# EAGLE design Mutli-Stepper-Driver Rev 2 MRlocal (EAGLE 8.0.0)

## Sheet 1 of 5
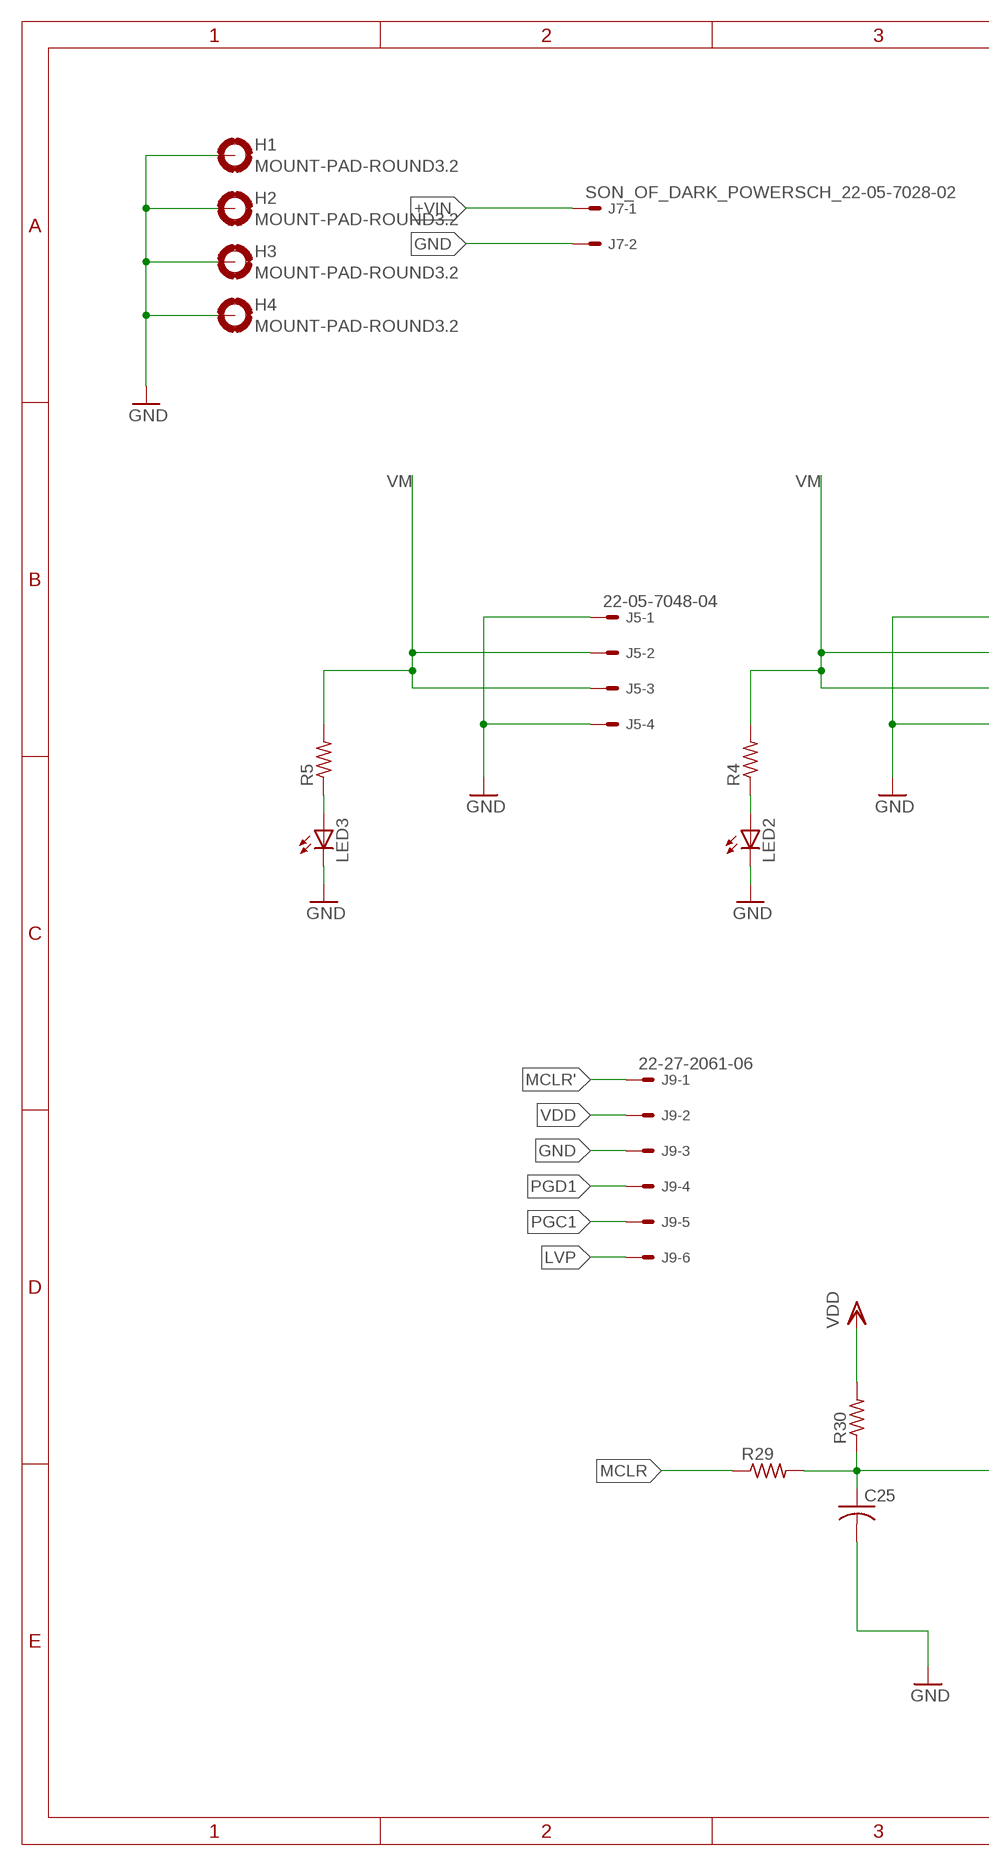
[diagram p0: schematic, sheet 1, part 1 of 2]
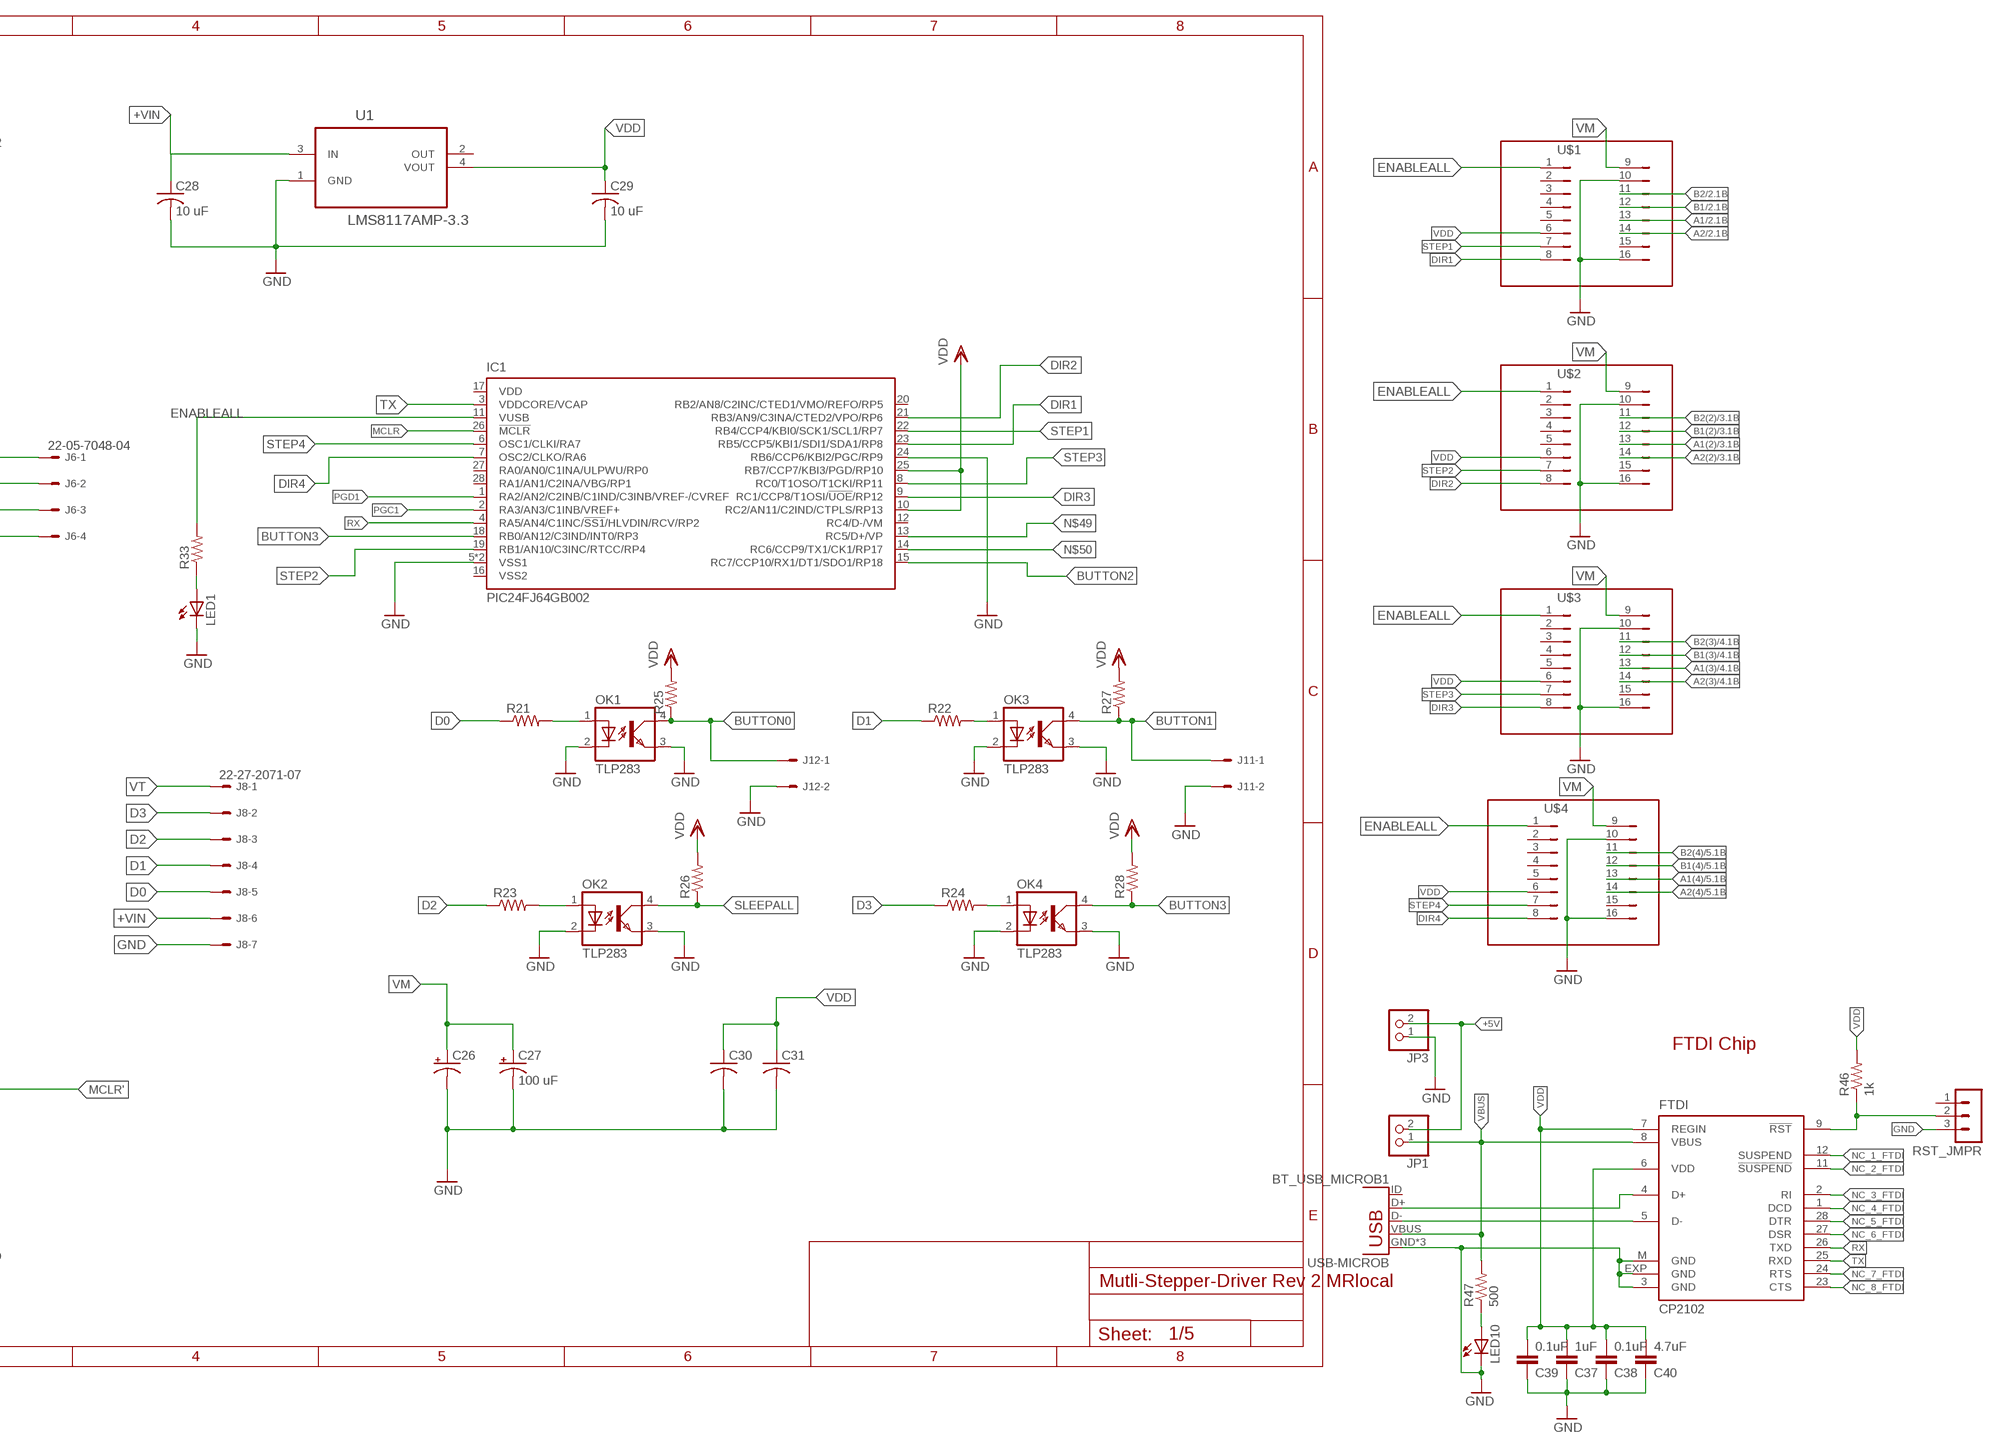
[diagram p1: schematic, sheet 1, part 2 of 2]

### Parts
BT_USB_MICROB1  USB-MICROB  [USB-MICROB]
C25  C-USC0805  [C0805]
C26  CPOL-USCT7343  [CT7343]
C27  100 uF  CPOL-USCT7343  [CT7343]
C28  10 uF  C-USC3216  [C3216]
C29  10 uF  C-USC3216  [C3216]
C30  C-USC0805  [C0805]
C31  C-USC0805  [C0805]
C37  1uF  C-EUC0805  [C0805]
C38  0.1uF  C-EUC0805  [C0805]
C39  0.1uF  C-EUC0805  [C0805]
C40  4.7uF  C-EUC0805  [C0805]
FTDI  CP2102  [MLP28]
H1  MOUNT-PAD-ROUND3.2  [3,2-PAD]
H2  MOUNT-PAD-ROUND3.2  [3,2-PAD]
H3  MOUNT-PAD-ROUND3.2  [3,2-PAD]
H4  MOUNT-PAD-ROUND3.2  [3,2-PAD]
IC1  PIC24FJ64GB002  MICROCHIP_PIC18F2J53ML  [MICROCHIP_QFN28-ML_6X6MM]
J5  22-05-7048-04  [7395-04]
J6  22-05-7048-04  [7395-04]
J7  SON_OF_DARK_POWERSCH_22-05-7028-02  [SON_OF_DARK_POWERSCH_7395-02]
J8  22-27-2071-07  [6410-07]
J9  22-27-2061-06  [6410-06]
J11  SON_OF_DARK_POWERSCH_22-05-7028-02  [SON_OF_DARK_POWERSCH_7395-02]
J12  SON_OF_DARK_POWERSCH_22-05-7028-02  [SON_OF_DARK_POWERSCH_7395-02]
JP1  PINHD-1X2  [1X02]
JP3  PINHD-1X2  [1X02]
LED1  LEDCHIPLED_0805  [CHIPLED_0805]
LED2  LEDCHIPLED_0805  [CHIPLED_0805]
LED3  LEDCHIPLED_0805  [CHIPLED_0805]
LED10  LEDSML0603  [SML0603]
OK1  TLP283  [MINI-FLAT-4]
OK2  TLP283  [MINI-FLAT-4]
OK3  TLP283  [MINI-FLAT-4]
OK4  TLP283  [MINI-FLAT-4]
R4  R-US_R0805  [R0805]
R5  R-US_R0805  [R0805]
R21  R-US_R0805  [R0805]
R22  R-US_R0805  [R0805]
R23  R-US_R0805  [R0805]
R24  R-US_R0805  [R0805]
R25  R-US_R0805  [R0805]
R26  R-US_R0805  [R0805]
R27  R-US_R0805  [R0805]
R28  R-US_R0805  [R0805]
R29  R-US_R0805  [R0805]
R30  R-US_R0805  [R0805]
R33  R-US_R0805  [R0805]
R46  1k  R-US_R0805  [R0805]
R47  500  R-US_R0805  [R0805]
RST_JMPR  MA03-1  [MA03-1]
U1  LMS8117AMP-3.3  NSC-LMS8117AMP_LMS8117AMP-3.3  [NSC-LMS8117AMP_SOT230P696X180-4N]
U$1  DRIVER  [6410-08]
U$2  DRIVER  [6410-08]
U$3  DRIVER  [6410-08]
U$4  DRIVER  [6410-08]

### Nets
+5V: JP1.2 JP3.2
+VIN: C28.1 J7.1 J8.6 U1.3(IN)
A1: U$1.13 ; also sheet 2
A1(2): U$2.13 ; also sheet 3
A1(3): U$3.13 ; also sheet 4
A1(4): U$4.13 ; also sheet 5
A2: U$1.14 ; also sheet 2
A2(2): U$2.14 ; also sheet 3
A2(3): U$3.14 ; also sheet 4
A2(4): U$4.14 ; also sheet 5
B1: U$1.12 ; also sheet 2
B1(2): U$2.12 ; also sheet 3
B1(3): U$3.12 ; also sheet 4
B1(4): U$4.12 ; also sheet 5
B2: U$1.11 ; also sheet 2
B2(2): U$2.11 ; also sheet 3
B2(3): U$3.11 ; also sheet 4
B2(4): U$4.11 ; also sheet 5
BT_D+: BT_USB_MICROB1.D+ FTDI.4(D+)
BT_D-: BT_USB_MICROB1.D- FTDI.5(D-)
BUTTON0: J12.1 OK1.4(COL) R25.1
BUTTON1: J11.1 OK3.4(COL) R27.1
BUTTON2: IC1.15(RC7/CCP10/RX1/DT1/SDO1/RP18)
BUTTON3: IC1.18(RB0/AN12/C3IND/INT0/RP3) OK4.4(COL) R28.1
D0: J8.5 R21.1
D1: J8.4 R22.1
D2: J8.3 R23.1
D3: J8.2 R24.1
DIR1: IC1.23(RB5/CCP5/KBI1/SDI1/SDA1/RP8) U$1.8
DIR2: IC1.21(RB3/AN9/C3INA/CTED2/VPO/RP6) U$2.8
DIR3: IC1.9(RC1/CCP8/T1OSI/!UOE!/RP12) U$3.8
DIR4: IC1.7(OSC2/CLKO/RA6) U$4.8
ENABLEALL: IC1.11(VUSB) R33.2 U$1.1 U$2.1 U$3.1 U$4.1
GND: BT_USB_MICROB1.GND BT_USB_MICROB1.MT1(GND) BT_USB_MICROB1.MT2(GND) C25.2 C26.- C27.- C28.2 C29.2 C30.2 C31.2 C37.1 C38.1 C39.1 C40.1 FTDI.3(GND) FTDI.EXP(GND) FTDI.M(GND) H1.B3,2(MOUNT) H2.B3,2(MOUNT) H3.B3,2(MOUNT) H4.B3,2(MOUNT) IC1.5(VSS1) IC1.24(RB6/CCP6/KBI2/PGC/RP9) IC1.EXP(VSS1) J5.1 J5.4 J6.1 J6.4 J7.2 J8.7 J9.3 J11.2 J12.2 JP3.1 LED1.C LED2.C LED3.C LED10.C OK1.2(C) OK1.3(EMIT) OK2.2(C) OK2.3(EMIT) OK3.2(C) OK3.3(EMIT) OK4.2(C) OK4.3(EMIT) RST_JMPR.3 U1.1(GND) U$1.10 U$1.16 U$2.10 U$2.16 U$3.10 U$3.16 U$4.10 U$4.16
LVP: J9.6
MCLR: IC1.26(!MCLR) R29.1
MCLR': C25.1 J9.1 R29.2 R30.1
N$2: LED2.A R4.1
N$9: FTDI.9(!RST) R46.1 RST_JMPR.2
N$10: LED10.A R47.1
N$12: LED3.A R5.1
N$37: OK2.1(A) R23.2
N$40: OK4.1(A) R24.2
N$42: LED1.A R33.1
N$43: OK1.1(A) R21.2
N$47: OK3.1(A) R22.2
N$49: IC1.13(RC5/D+/VP)
N$50: IC1.14(RC6/CCP9/TX1/CK1/RP17)
NC_1_FTDI: FTDI.12(SUSPEND)
NC_2_FTDI: FTDI.11(!SUSPEND)
NC_3_FTDI: FTDI.2(RI)
NC_4_FTDI: FTDI.1(DCD)
NC_5_FTDI: FTDI.28(DTR)
NC_6_FTDI: FTDI.27(DSR)
NC_7_FTDI: FTDI.24(RTS)
NC_8_FTDI: FTDI.23(CTS)
PGC1: IC1.2(RA3/AN3/C1INB/VREF+) J9.5
PGD1: IC1.1(RA2/AN2/C2INB/C1IND/C3INB/VREF-/CVREF) J9.4
RX: FTDI.26(TXD) IC1.4(RA5/AN4/C1INC/!SS1!/HLVDIN/RCV/RP2)
SLEEPALL: OK2.4(COL) R26.1
STEP1: IC1.22(RB4/CCP4/KBI0/SCK1/SCL1/RP7) U$1.7
STEP2: IC1.19(RB1/AN10/C3INC/RTCC/RP4) U$2.7
STEP3: IC1.8(RC0/T1OSO/T1CKI/RP11) U$3.7
STEP4: IC1.6(OSC1/CLKI/RA7) U$4.7
TX: FTDI.25(RXD) IC1.3(VDDCORE/VCAP)
VBUS: BT_USB_MICROB1.VBUS FTDI.8(VBUS) JP1.1 R47.2
VDD: C29.1 C30.1 C31.1 C37.2 C38.2 C39.2 C40.2 FTDI.6(VDD) FTDI.7(REGIN) IC1.10(RC2/AN11/C2IND/CTPLS/RP13) IC1.25(RB7/CCP7/KBI3/PGD/RP10) J9.2 R25.2 R26.2 R27.2 R28.2 R30.2 R46.2 U1.4(VOUT) U$1.6 U$2.6 U$3.6 U$4.6
VM: C26.+ C27.+ J5.2 J5.3 J6.2 J6.3 R4.2 R5.2 U$1.9 U$2.9 U$3.9 U$4.9
VT: J8.1
Unconnected: BT_USB_MICROB1.ID IC1.12(RC4/D-/VM) IC1.16(VSS2) IC1.17(VDD) IC1.20(RB2/AN8/C2INC/CTED1/VMO/REFO/RP5) IC1.27(RA0/AN0/C1INA/ULPWU/RP0) IC1.28(RA1/AN1/C2INA/VBG/RP1) RST_JMPR.1 U1.2(OUT) U$1.2 U$1.3 U$1.4 U$1.5 U$1.15 U$2.2 U$2.3 U$2.4 U$2.5 U$2.15 U$3.2 U$3.3 U$3.4 U$3.5 U$3.15 U$4.2 U$4.3 U$4.4 U$4.5 U$4.15

### Notes on the sheet
- FTDI Chip

## Sheet 2 of 5
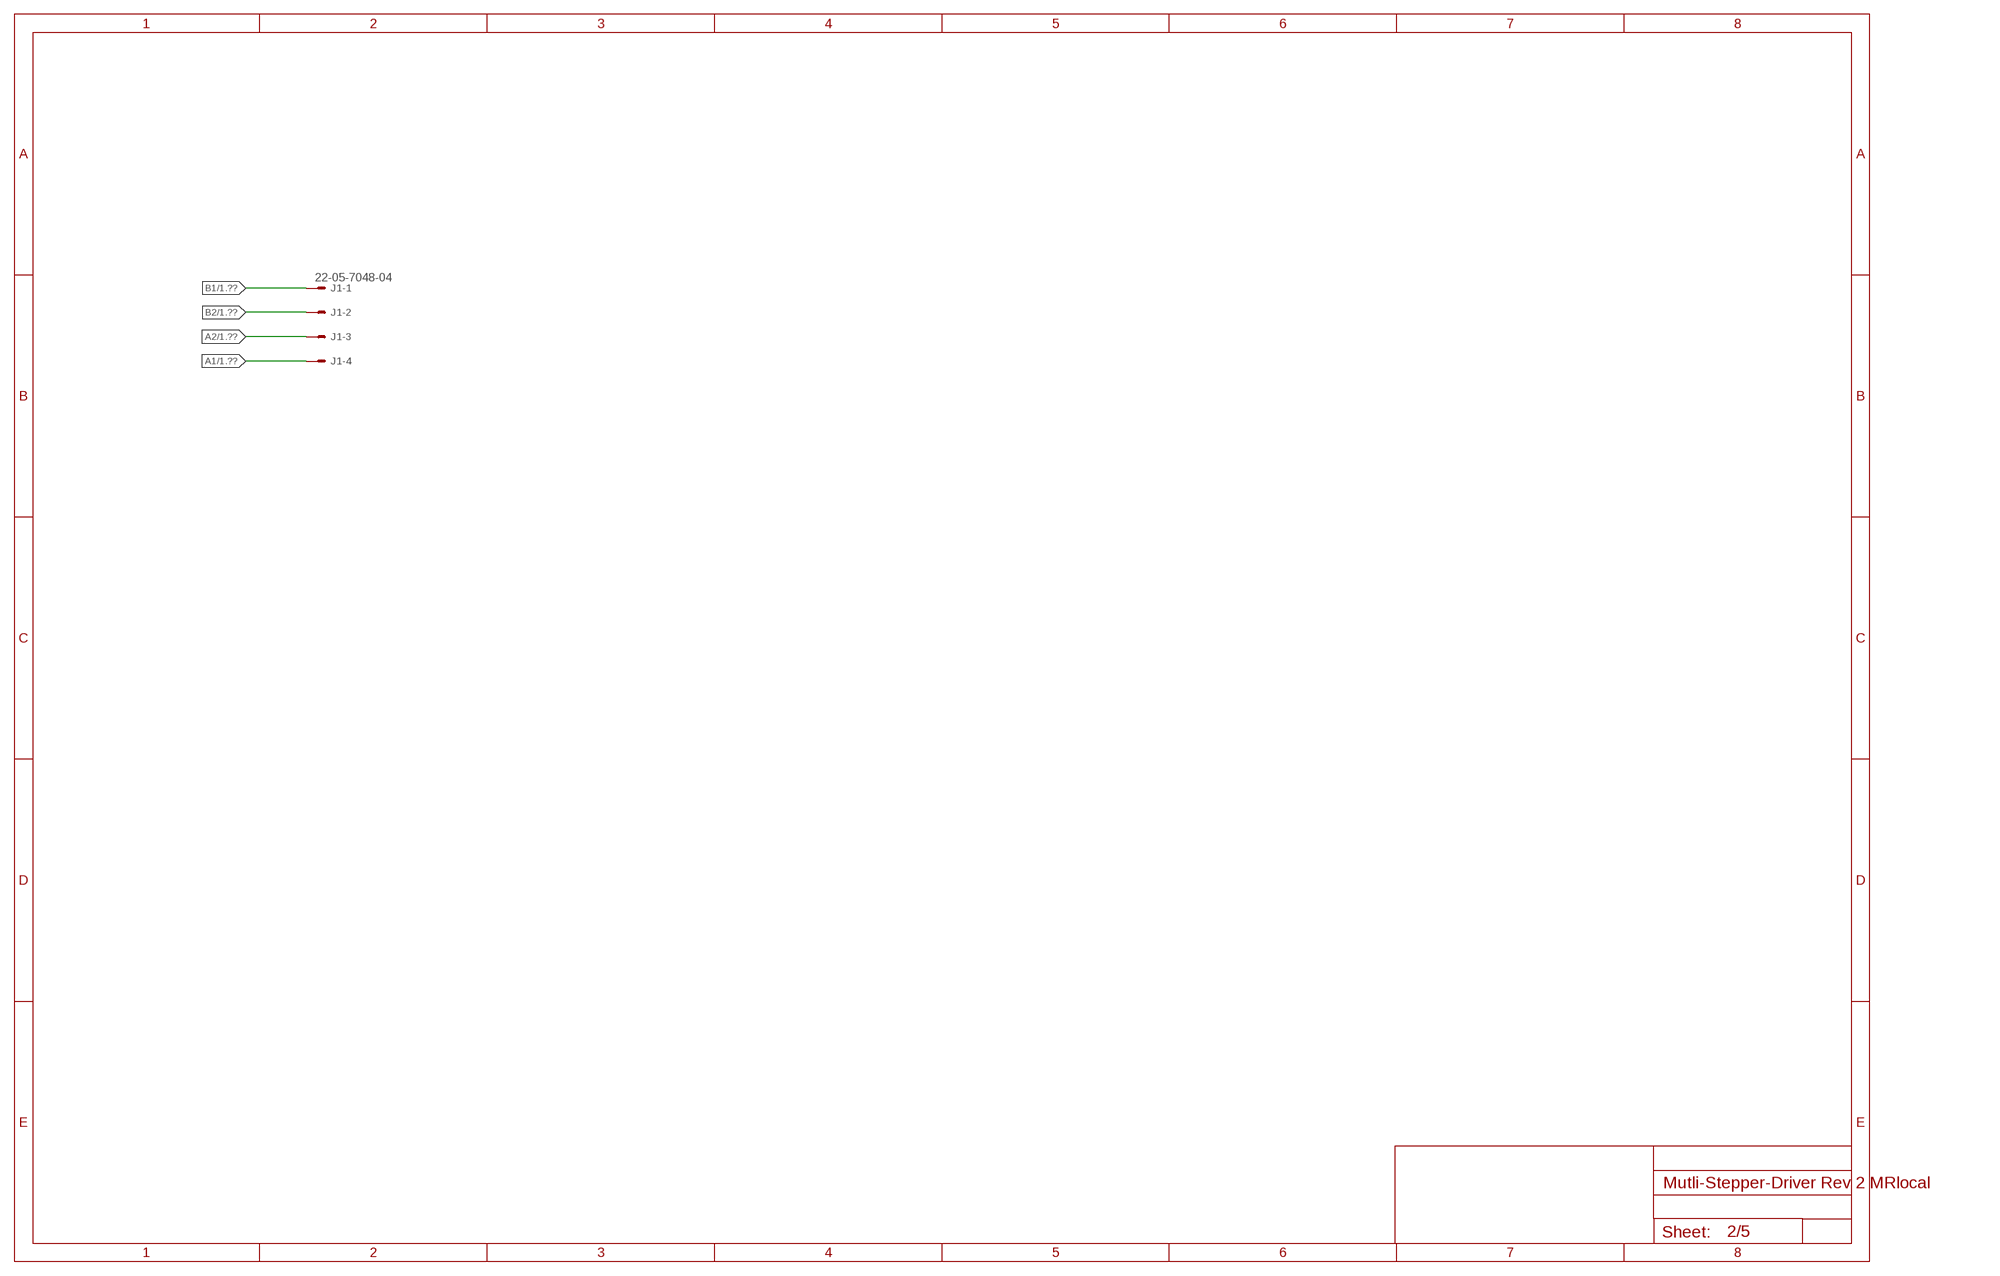
[diagram p2: schematic, sheet 2]

### Parts
J1  22-05-7048-04  [7395-04]

### Nets
A1: J1.4 ; also sheet 1
A2: J1.3 ; also sheet 1
B1: J1.1 ; also sheet 1
B2: J1.2 ; also sheet 1

## Sheet 3 of 5
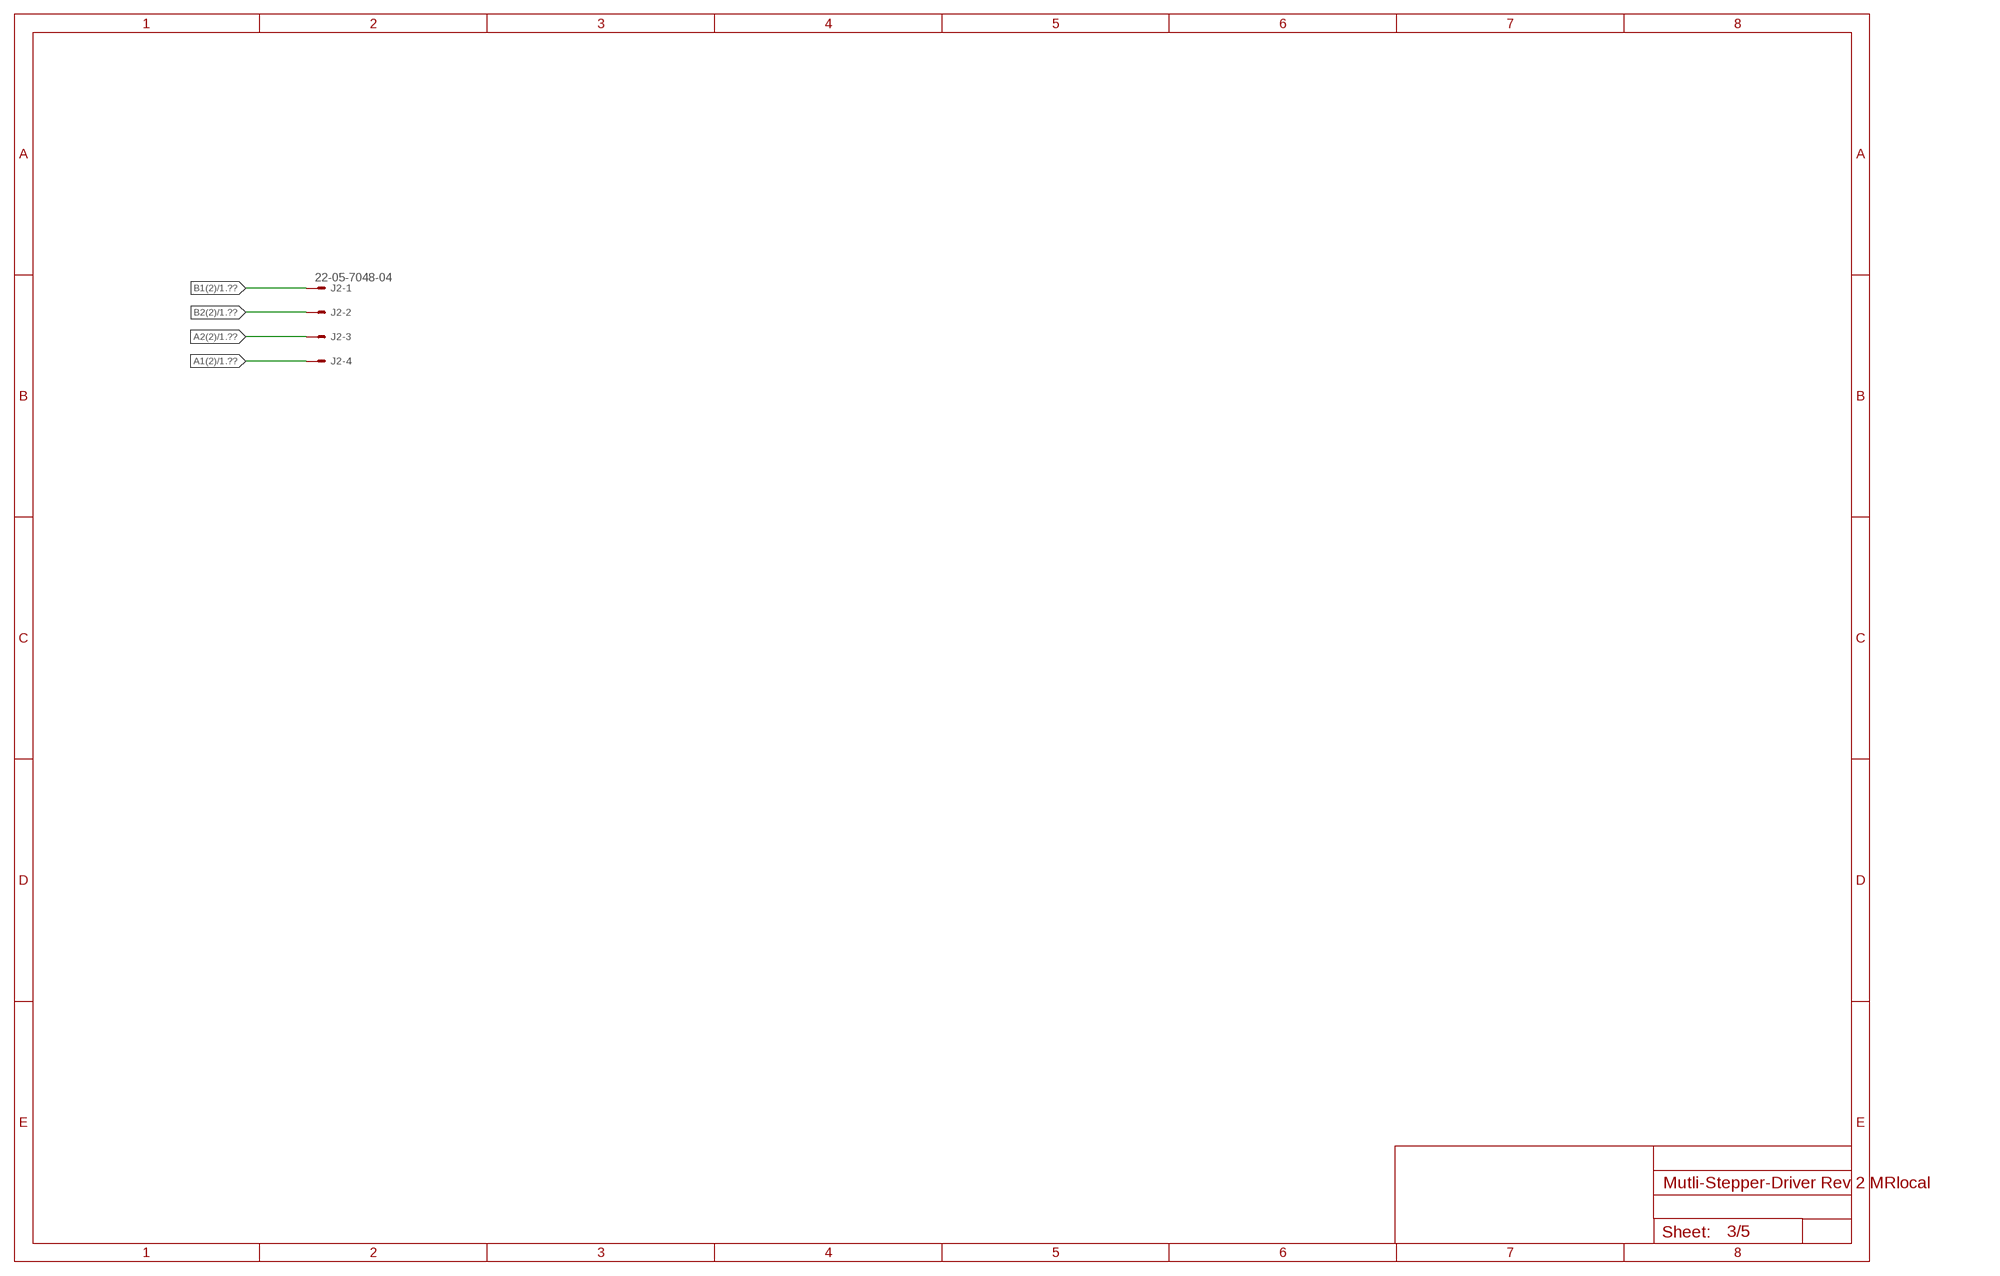
[diagram p3: schematic, sheet 3]

### Parts
J2  22-05-7048-04  [7395-04]

### Nets
A1(2): J2.4 ; also sheet 1
A2(2): J2.3 ; also sheet 1
B1(2): J2.1 ; also sheet 1
B2(2): J2.2 ; also sheet 1

## Sheet 4 of 5
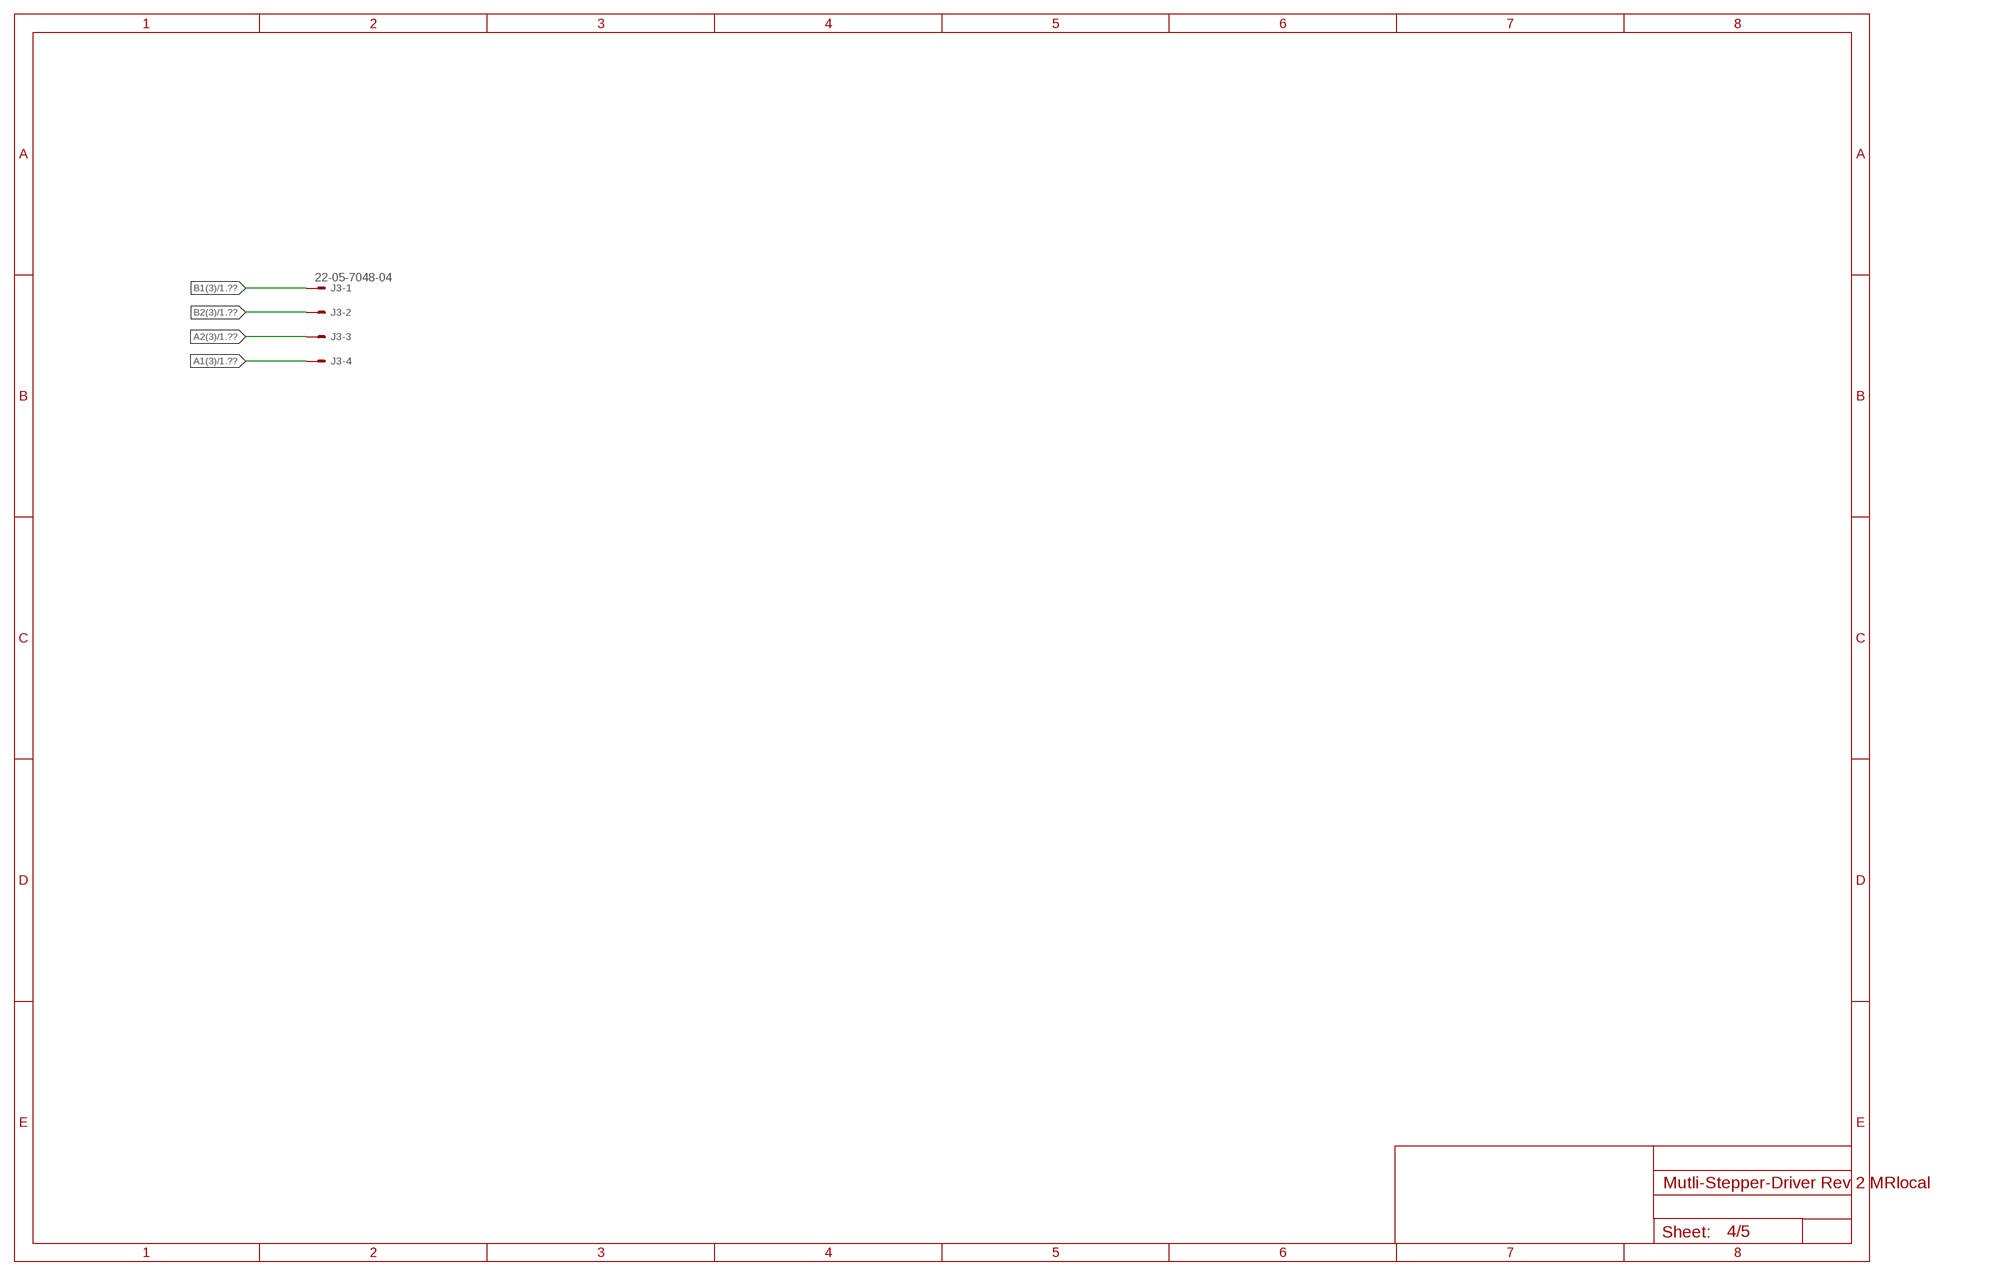
[diagram p4: schematic, sheet 4]

### Parts
J3  22-05-7048-04  [7395-04]

### Nets
A1(3): J3.4 ; also sheet 1
A2(3): J3.3 ; also sheet 1
B1(3): J3.1 ; also sheet 1
B2(3): J3.2 ; also sheet 1

## Sheet 5 of 5
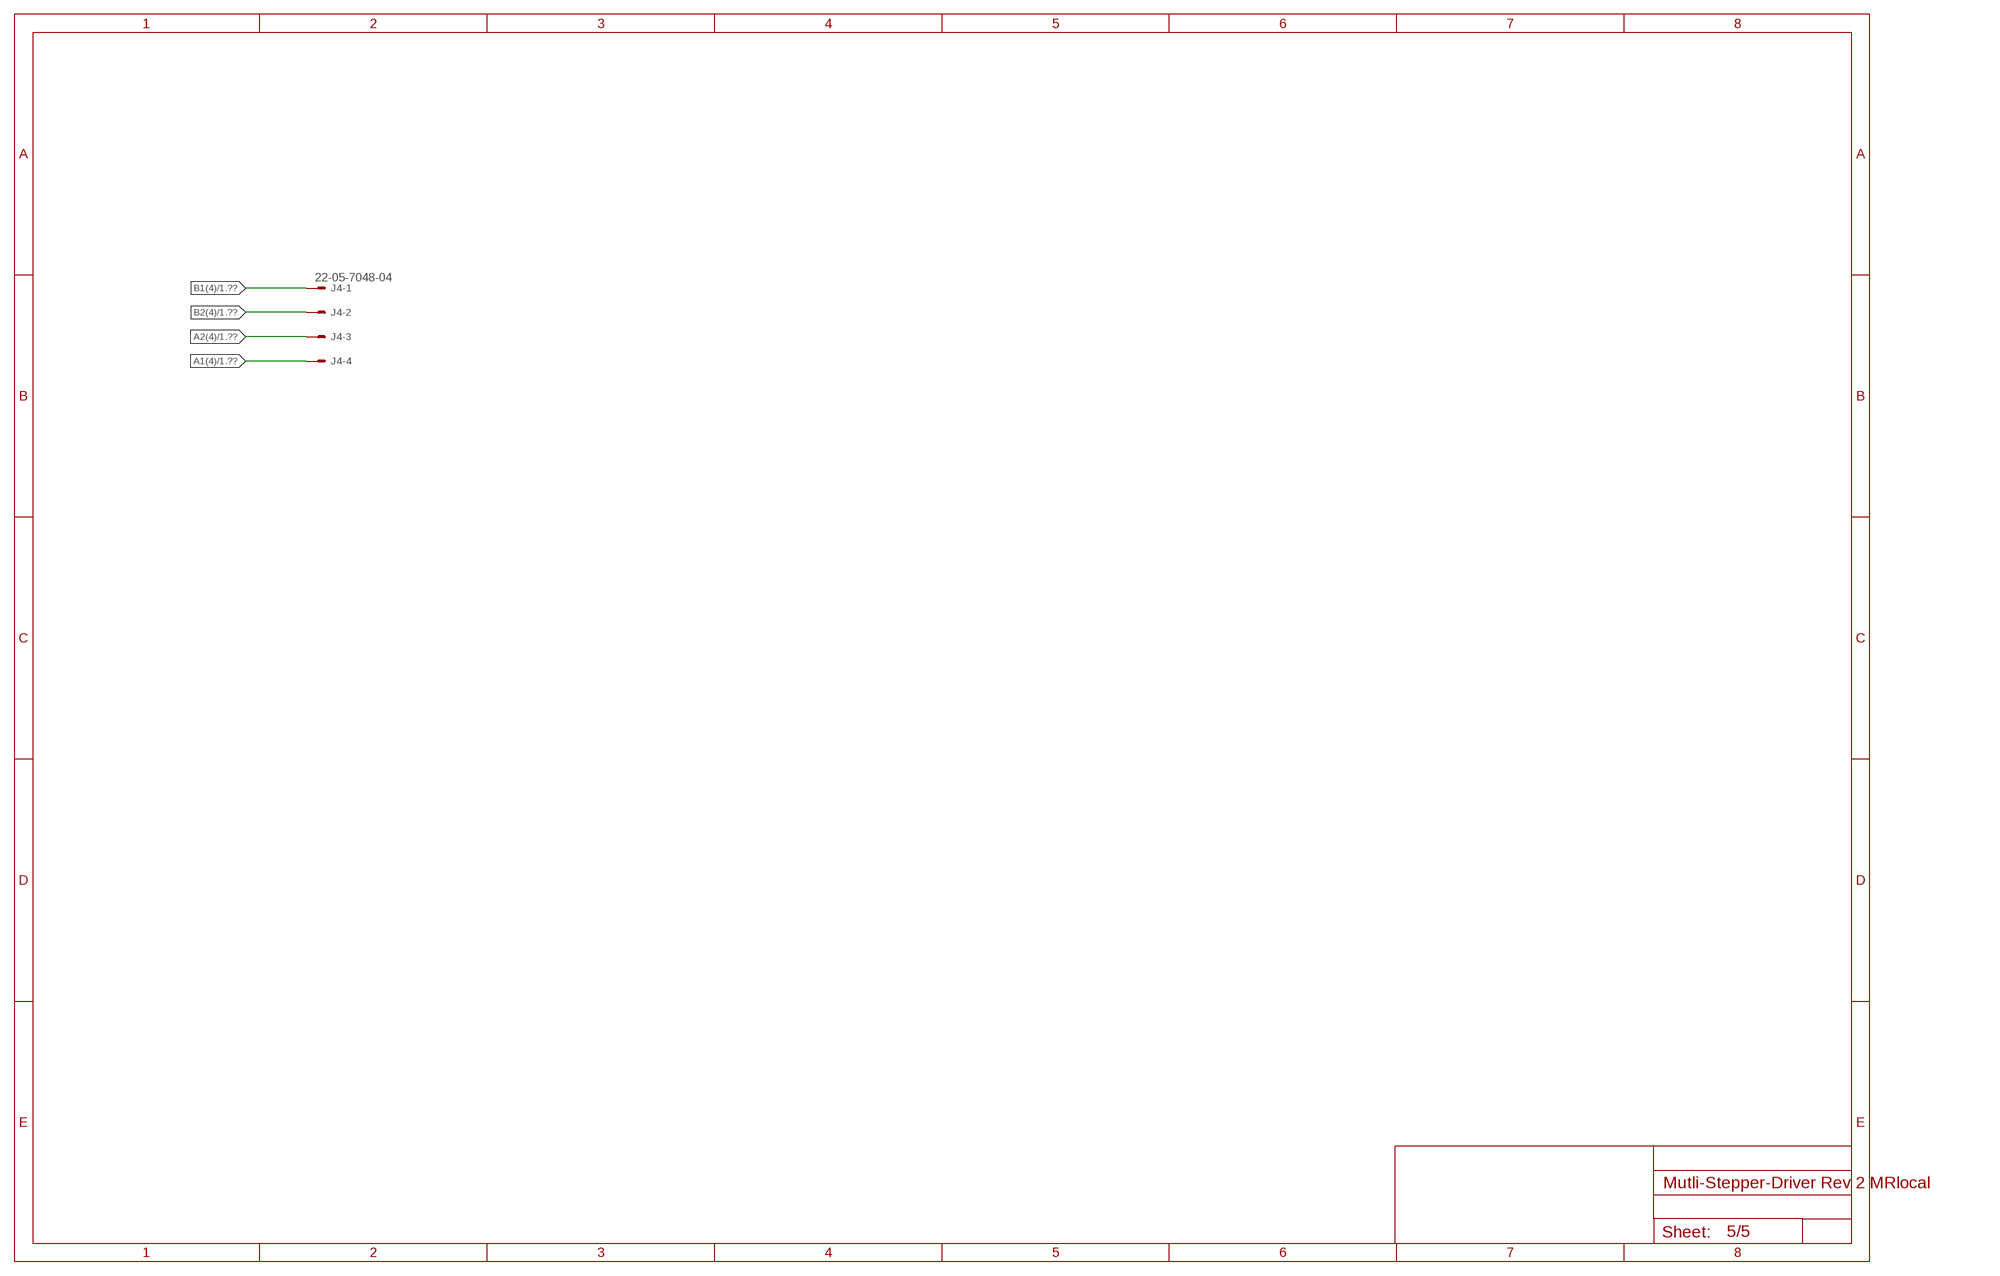
[diagram p5: schematic, sheet 5]

### Parts
J4  22-05-7048-04  [7395-04]

### Nets
A1(4): J4.4 ; also sheet 1
A2(4): J4.3 ; also sheet 1
B1(4): J4.1 ; also sheet 1
B2(4): J4.2 ; also sheet 1

## Library data of the parts
BT_USB_MICROB1 = Mother-Board-rev5:USB: USB Connectors USB-B-PTH is fully proven SKU : PRT-00139/CONN-08278 USB-miniB is fully proven SKU : PRT-00587 USB-A-PCB is untested. USB-A-H is throughly reviewed, but untested. Spark Fun Electronics SKU : PRT-00437 USB-B-SMT is throughly reviewed, but untested. Needs silkscreen touching up. USB-A-S has not been used/tested USB-MB-H has not been used/tested USB-MICROB has been used. CONN-09505; PROD_ID: CONN-09505
C25 C28-C31 = rcl:C-US: CAPACITOR, American symbol
C26 C27 = rcl:CPOL-US: POLARIZED CAPACITOR, American symbol
C37-C40 = resistor:C-EU: CAPACITOR, European symbol
FTDI = silabs:CP210*: Single-Chip USB to UART Bridge Source: www.silabs.com .. CP2101.pdf / cp2102.pdf; MF: FARNELL; MPN: CP2102-GM; OC_FARNELL: 9282130; OC_NEWARK: 30K5635
H1-H4 = holes:MOUNT-PAD-ROUND: MOUNTING PAD, round
IC1 = MotherboardRev2:MICROCHIP_PIC18F2*J53: PIC18F47J53 Family High-Performance USB Microcontrollers with nanoWatt XLP Technology Source: Data sheet <http://ww1.microchip.com/downloads/en/DeviceDoc/39964B.pdf>
J1-J6 = Son_of_Dark_Power:22-?-04: CONNECTOR wire to board 2.54 mm (.1 inch) pitch header; OC_FARNELL: unknown; OC_NEWARK: unknown
J7 J11 J12 = MotherboardRev2:SON_OF_DARK_POWERSCH_22-?-02: CONNECTOR wire to board 2.54 mm (.1 inch) pitch header; OC_FARNELL: 9731601; OC_NEWARK: unknown
J8 = con-molex:22-?-07: CONNECTOR wire to board 2.54 mm (.1 inch) pitch header; OC_FARNELL: unknown; OC_NEWARK: unknown
J9 = con-molex:22-?-06: CONNECTOR wire to board 2.54 mm (.1 inch) pitch header; OC_FARNELL: unknown; OC_NEWARK: unknown
JP1 JP3 = pinhead:PINHD-1X2: PIN HEADER
LED1-LED3 = led:LED: LED OSRAM: - CHIPLED LG R971, LG N971, LY N971, LG Q971, LY Q971, LO R971, LY R971 LH N974, LH R974 LS Q976, LO Q976, LY Q976 LO Q996 - Hyper CHIPLED LW Q18S LB Q993, LB Q99A, LB R99A - SideLED LS A670, LO A670, LY A670, LG A670, LP A670 LB A673, LV A673, LT A673, LW A673 LH A674 LY A675 LS A676, LA A676, LO A676, LY A676, LW A676 LS A679, LY A679, LG A679 - Hyper Micro SIDELED® LS Y876, LA Y876, LO Y876, LY Y876 LT Y87S - SmartLED LW L88C, LW L88S LB L89C, LB L89S, LG L890 LS L89K, LO L89K, LY L89K LS L896, LA L896, LO L896, LY L896 - TOPLED LS T670, LO T670, LY T670, LG T670, LP T670 LSG T670, LSP T670, LSY T670, LOP T670, LYG T670 LG T671, LOG T671, LSG T671 LB T673, LV T673, LT T673, LW T673 LH T674 LS T676, LA T676, LO T676, LY T676, LB T676, LH T676, LSB T676, LW T676 LB T67C, LV T67C, LT T67C, LS T67K, LO T67K, LY T67K, LW E67C LS E67B, LA E67B, LO E67B, LY E67B, LB E67C, LV E67C, LT E67C LW T67C LS T679, LY T679, LG T679 LS T770, LO T770, LY T770, LG T770, LP T770 LB T773, LV T773, LT T773, LW T773 LH T774 LS E675, LA E675, LY E675, LS T675 LS T776, LA T776, LO T776, LY T776, LB T776 LHGB T686 LT T68C, LB T68C - Hyper Mini TOPLED® LB M676 - Mini TOPLED Santana® LG M470 LS M47K, LO M47K, LY M47K Source: http://www.osram.convergy.de LUXEON: - LUMILED® LXK2-PW12-R00, LXK2-PW12-S00, LXK2-PW14-U00, LXK2-PW14-V00 LXK2-PM12-R00, LXK2-PM12-S00, LXK2-PM14-U00 LXK2-PE12-Q00, LXK2-PE12-R00, LXK2-PE12-S00, LXK2-PE14-T00, LXK2-PE14-U00 LXK2-PB12-K00, LXK2-PB12-L00, LXK2-PB12-M00, LXK2-PB14-N00, LXK2-PB14-P00, LXK2-PB14-Q00 LXK2-PR12-L00, LXK2-PR12-M00, LXK2-PR14-Q00, LXK2-PR14-R00 LXK2-PD12-Q00, LXK2-PD12-R00, LXK2-PD12-S00 LXK2-PH12-R00, LXK2-PH12-S00 LXK2-PL12-P00, LXK2-PL12-Q00, LXK2-PL12-R00 Source: www.luxeon.com KINGBRIGHT: KA-3528ASYC Source: www.kingbright.com
LED10 = interface_board-rev13:LED: LED OSRAM: - CHIPLED LG R971, LG N971, LY N971, LG Q971, LY Q971, LO R971, LY R971 LH N974, LH R974 LS Q976, LO Q976, LY Q976 LO Q996 - Hyper CHIPLED LW Q18S LB Q993, LB Q99A, LB R99A - SideLED LS A670, LO A670, LY A670, LG A670, LP A670 LB A673, LV A673, LT A673, LW A673 LH A674 LY A675 LS A676, LA A676, LO A676, LY A676, LW A676 LS A679, LY A679, LG A679 - Hyper Micro SIDELED® LS Y876, LA Y876, LO Y876, LY Y876 LT Y87S - SmartLED LW L88C, LW L88S LB L89C, LB L89S, LG L890 LS L89K, LO L89K, LY L89K LS L896, LA L896, LO L896, LY L896 - TOPLED LS T670, LO T670, LY T670, LG T670, LP T670 LSG T670, LSP T670, LSY T670, LOP T670, LYG T670 LG T671, LOG T671, LSG T671 LB T673, LV T673, LT T673, LW T673 LH T674 LS T676, LA T676, LO T676, LY T676, LB T676, LH T676, LSB T676, LW T676 LB T67C, LV T67C, LT T67C, LS T67K, LO T67K, LY T67K, LW E67C LS E67B, LA E67B, LO E67B, LY E67B, LB E67C, LV E67C, LT E67C LW T67C LS T679, LY T679, LG T679 LS T770, LO T770, LY T770, LG T770, LP T770 LB T773, LV T773, LT T773, LW T773 LH T774 LS E675, LA E675, LY E675, LS T675 LS T776, LA T776, LO T776, LY T776, LB T776 LHGB T686 LT T68C, LB T68C - Hyper Mini TOPLED® LB M676 - Mini TOPLED Santana® LG M470 LS M47K, LO M47K, LY M47K Source: http://www.osram.convergy.de LUXEON: - LUMILED® LXK2-PW12-R00, LXK2-PW12-S00, LXK2-PW14-U00, LXK2-PW14-V00 LXK2-PM12-R00, LXK2-PM12-S00, LXK2-PM14-U00 LXK2-PE12-Q00, LXK2-PE12-R00, LXK2-PE12-S00, LXK2-PE14-T00, LXK2-PE14-U00 LXK2-PB12-K00, LXK2-PB12-L00, LXK2-PB12-M00, LXK2-PB14-N00, LXK2-PB14-P00, LXK2-PB14-Q00 LXK2-PR12-L00, LXK2-PR12-M00, LXK2-PR14-Q00, LXK2-PR14-R00 LXK2-PD12-Q00, LXK2-PD12-R00, LXK2-PD12-S00 LXK2-PH12-R00, LXK2-PH12-S00 LXK2-PL12-P00, LXK2-PL12-Q00, LXK2-PL12-R00 Source: www.luxeon.com KINGBRIGHT: KA-3528ASYC Source: www.kingbright.com
OK1-OK4 = optocoupler:TLP283: TOSHIBA PHOTOCOUPLER GaAs IRED & PHOTO-TRANSISTOR Source: http://www.semicon.toshiba.co.jp/td/en/Opto/Photocoupler/en_20050928_TLP283_datasheet.pdf; OC_FARNELL: unknown; OC_NEWARK: unknown
R4 R5 R21-R30 R33 = rcl:R-US_: RESISTOR, American symbol
R46 R47 = resistor:R-US_: RESISTOR, American symbol
RST_JMPR = con-lstb:MA03-1: PIN HEADER; OC_FARNELL: unknown; OC_NEWARK: unknown
U1 = MotherboardRev2:NSC-LMS8117AMP_LMS8117AMP-3.3: Low-Dropout Linear Regulator; MPN: LMS8117AMP-3.3; OC_FARNELL: 1469032; OC_NEWARK: 41K3020; PACKAGE: SOT-223-3; SUPPLIER: National Semiconductor
U$1-U$4 = con-molex:DRIVER

## Board
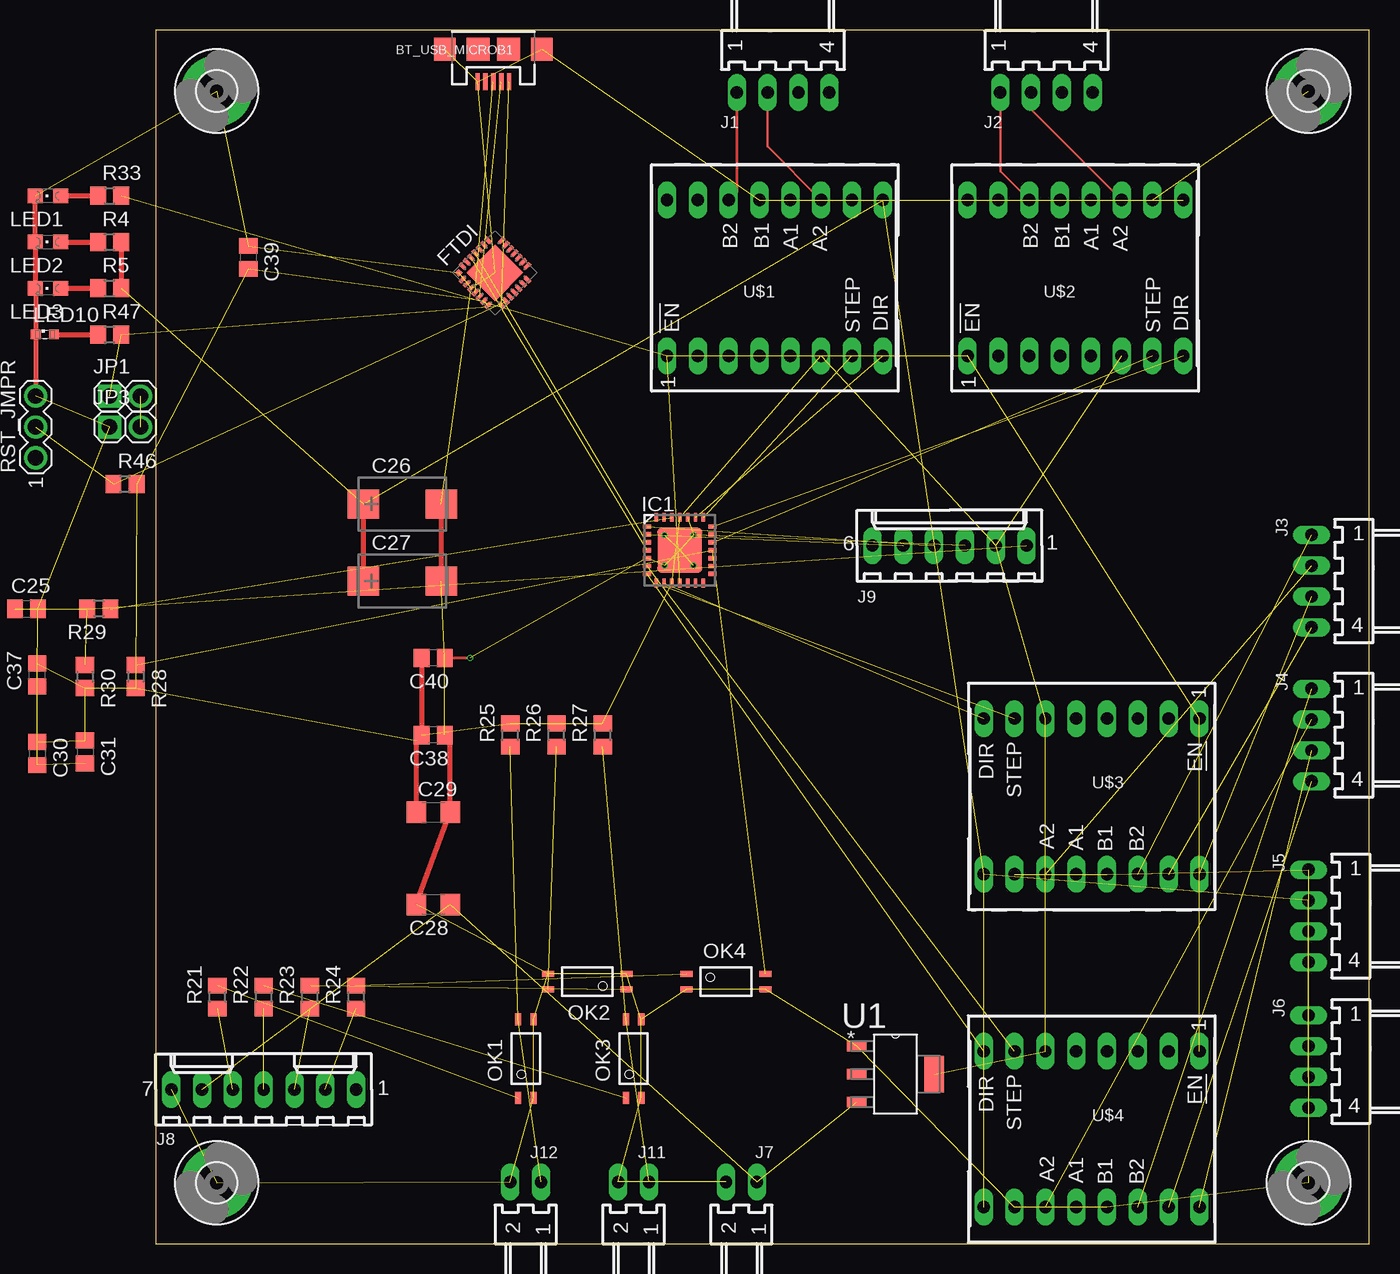
[diagram p6: board, top side]
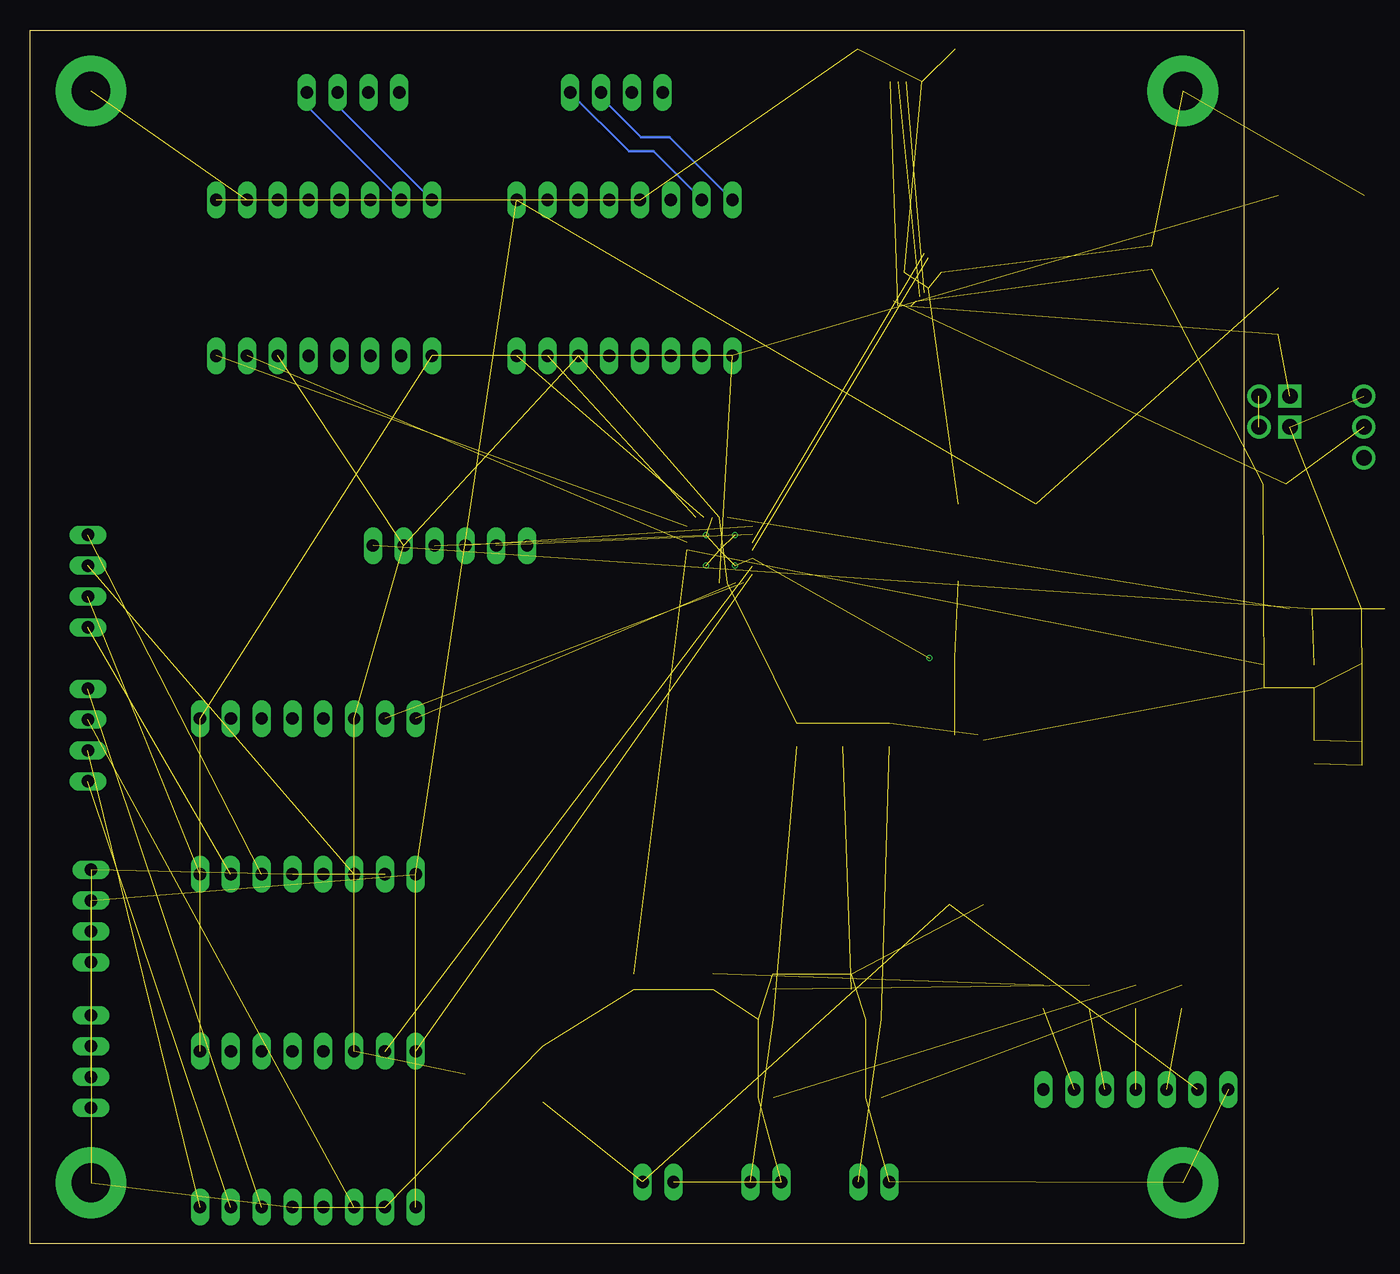
[diagram p7: board, bottom side, seen from below]

Size 100 x 100 mm. Coordinates in mm from the lower left corner, seen from the top.
Outline: 0,0 100,0 100,100 0,100 0,0
Copper layers (1*16): Top 0.035mm / dielectric 1.5mm / Bottom 0.035mm
Design rules "EagleRules-2-Layer-Shep": minimum track width 6mil, minimum drill 12mil, track to track 6mil, track to pad 6mil, pad to pad 6mil, via to via 6mil, smd to smd 0mil, copper to edge 10mil, drill to drill 10mil, minimum pad ring 2mil, minimum via ring 2mil, stop-mask expansion 2mil, vias tented up to drill 100mil, thermal gap 10mil

### Footprints (pad centres in the part's own frame; a part is rotated, then mirrored left to right if it is on the bottom)
USB-MICROB = smd 0.35 x 1.4: D+ 0,2.65; D- -0.65,2.65; GND 1.3,2.65; ID 0.65,2.65; VBUS -1.3,2.65 | smd 1.8 x 1.9: MT1 -4,0; MT2 4,0 | smd 1.9 x 1.9: P$1 -1.27,0; P$2 1.27,0
C0805 = smd 1.3 x 1.5: 1 -0.95,0; 2 0.95,0
CT7343 = smd 2.6 x 2.4: + -3.2,0; - 3.2,0
C3216 = smd 1.6 x 1.8: 1 -1.4,0; 2 1.4,0
MLP28 = smd 0.6 x 0.3: 1 -2.3,1.5; 2 -2.3,1; 3 -2.3,0.5; 4 -2.3,0; 5 -2.3,-0.5; 6 -2.3,-1; 7 -2.3,-1.5; 15 2.3,-1.5; 16 2.3,-1; 17 2.3,-0.5; 18 2.3,0; 19 2.3,0.5; 20 2.3,1; 21 2.3,1.5 | smd 0.3 x 0.6: 8 -1.5,-2.3; 9 -1,-2.3; 10 -0.5,-2.3; 11 0,-2.3; 12 0.5,-2.3; 13 1,-2.3; 14 1.5,-2.3; 22 1.5,2.3; 23 1,2.3; 24 0.5,2.3; 25 0,2.3; 26 -0.5,2.3; 27 -1,2.3; 28 -1.5,2.3 | smd 3.3 x 3.3: EXP 0,0 | smd 0.435 x 0.435: M -2.103,2.103
3,2-PAD = drill 3.2 pad 5.842: B3,2 0,0
MICROCHIP_QFN28-ML_6X6MM = smd 0.7 x 0.35: 1 -2.7,1.95; 2 -2.7,1.3; 3 -2.7,0.65; 4 -2.7,0; 5 -2.7,-0.65; 6 -2.7,-1.3; 7 -2.7,-1.95; 15 2.7,-1.95; 16 2.7,-1.3; 17 2.7,-0.65; 18 2.7,0; 19 2.7,0.65; 20 2.7,1.3; 21 2.7,1.95 | smd 0.35 x 0.7: 8 -1.95,-2.7; 9 -1.3,-2.7; 10 -0.65,-2.7; 11 0,-2.7; 12 0.65,-2.7; 13 1.3,-2.7; 14 1.95,-2.7; 22 1.95,2.7; 23 1.3,2.7; 24 0.65,2.7; 25 0,2.7; 26 -0.65,2.7; 27 -1.3,2.7; 28 -1.95,2.7 | smd 3.7 x 3.7: EXP 0,0
7395-04 = drill 1.016 long: 1 3.81,0; 2 1.27,0; 3 -1.27,0; 4 -3.81,0
SON_OF_DARK_POWERSCH_7395-02 = drill 1.016 long: 1 1.27,0; 2 -1.27,0
6410-07 = drill 1.016 long: 1 7.62,0; 2 5.08,0; 3 2.54,0; 4 0,0; 5 -2.54,0; 6 -5.08,0; 7 -7.62,0
6410-06 = drill 1.016 long: 1 6.35,0; 2 3.81,0; 3 1.27,0; 4 -1.27,0; 5 -3.81,0; 6 -6.35,0
1X02 = drill 1.27 square: 1 -1.27,0 | drill 1.27: 2 1.27,0
CHIPLED_0805 = smd 1.2 x 1.2: A 0,-1.05; C 0,1.05
SML0603 = smd 0.8 x 0.8: A 0.75,0; C -0.75,0
MINI-FLAT-4 = smd 1 x 0.5: 1 -3.24,0.635; 2 -3.24,-0.635; 3 3.24,-0.635; 4 3.24,0.635
R0805 = smd 1.3 x 1.5: 1 -0.95,0; 2 0.95,0
MA03-1 = drill 1.27: 1 -2.54,0; 2 0,0; 3 2.54,0
NSC-LMS8117AMP_SOT230P696X180-4N = smd 1.6 x 0.838: 1 -3.2,2.311; 2 -3.2,0; 3 -3.2,-2.311 | smd 1.6 x 3.023: 4 3.2,0
6410-08 = drill 1.016 long: 1 -0.1,13.62; 2 -0.1,11.08; 3 -0.1,8.54; 4 -0.1,6; 5 -0.1,3.46; 6 -0.1,0.92; 7 -0.1,-1.62; 8 -0.1,-4.16; 9 12.74,-4.16; 10 12.74,-1.62; 11 12.74,0.92; 12 12.74,8.54; 13 12.74,11.08; 14 12.74,13.62; 15 12.74,3.46; 16 12.74,6

### Placement (x,y rotation side)
BT_USB_MICROB1  27.81,98.42 180 top
C25  -10.67,52.32 0 top  (outside the outline)
C26  20.32,60.96 0 top
C27  20.32,54.61 0 top
C28  22.86,27.94 180 top
C29  22.86,35.56 0 top
C30  -9.78,40.39 270 top  (outside the outline)
C31  -5.84,40.51 270 top  (outside the outline)
C37  -9.78,46.86 90 top  (outside the outline)
C38  22.86,41.91 180 top
C39  7.62,81.28 270 top
C40  22.86,48.26 180 top
FTDI  27.94,80.01 45 top
H1  5,5 0 top
H2  5,95 0 top
H3  95,95 0 top
H4  95,5 0 top
IC1  43.18,57.15 0 top
J1  51.69,94.87 180 top
J2  73.41,94.87 180 top
J3  95.25,54.61 90 top
J4  95.25,41.91 90 top
J5  95,27 90 top
J6  95,15 90 top
J7  48.26,5.08 0 top
J8  8.89,12.7 0 top
J9  65.41,57.53 0 top
J11  39.37,5.08 0 top
J12  30.48,5.08 0 top
JP1  -2.54,69.85 0 top
JP3  -2.54,67.31 0 top
LED1  -8.89,86.36 90 top  (outside the outline)
LED2  -8.89,82.55 90 top  (outside the outline)
LED3  -8.89,78.74 90 top  (outside the outline)
LED10  -9.14,74.93 0 top  (outside the outline)
OK1  30.48,15.24 90 top
OK2  35.56,21.59 180 top
OK3  39.37,15.24 90 top
OK4  46.99,21.59 0 top
R4  -3.81,82.55 0 top
R5  -3.81,78.74 0 top
R21  5.08,20.32 90 top
R22  8.89,20.32 90 top
R23  12.7,20.32 90 top
R24  16.51,20.32 90 top
R25  29.21,41.91 90 top
R26  33.02,41.91 90 top
R27  36.83,41.91 90 top
R28  -1.65,46.74 270 top
R29  -4.7,52.32 180 top  (outside the outline)
R30  -5.84,46.74 270 top  (outside the outline)
R33  -3.81,86.36 0 top
R46  -2.54,62.61 0 top
R47  -3.81,74.93 0 top
RST_JMPR  -9.91,67.31 90 top  (outside the outline)
U1  60.96,13.97 0 top
U$1  55.75,73.28 90 top
U$2  80.52,73.28 90 top
U$3  72.39,43.18 270 top
U$4  72.39,15.75 270 top

### Tracks (layer width: path | path; a pad name or v marks a point on that pad's centre or on a via)
+5V  (1 unrouted)
+VIN  (3 unrouted)
A1
  Bottom 0.203: J1.4 50.67,90.04 48.64,90.04 44.67,86.08 U$1.13
A1(2)
  Bottom 0.203: U$2.13 77.22,93.8 J2.4
A1(3)  (1 unrouted)
A1(4)  (1 unrouted)
A2
  Bottom 0.203: U$1.14 47.3,91.19 49.66,91.19 52.96,94.49 J1.3
A2(2)
  Bottom 0.203: U$2.14 74.68,93.8 J2.3
A2(3)  (1 unrouted)
A2(4)  (1 unrouted)
B1
  Top 0.203: U$1.12 47.88,86.69 J1.1
B1(2)
  Top 0.203: U$2.12 69.6,88.4 J2.1
B1(3)  (1 unrouted)
B1(4)  (1 unrouted)
B2
  Top 0.203: U$1.11 50.42,90.43 J1.2
B2(2)
  Top 0.203: U$2.11 72.14,93.48 J2.2
B2(3)  (1 unrouted)
B2(4)  (1 unrouted)
BT_D+  (1 unrouted)
BT_D-  (1 unrouted)
BUTTON0  (2 unrouted)
BUTTON1  (2 unrouted)
BUTTON3  (2 unrouted)
D0  (1 unrouted)
D1  (1 unrouted)
D2  (1 unrouted)
D3  (1 unrouted)
DIR1  (1 unrouted)
DIR2  (1 unrouted)
DIR3  (1 unrouted)
DIR4  (1 unrouted)
ENABLEALL  (5 unrouted)
GND  (via drill 0.33)  (52 unrouted)
  Top 0.203: C40.1 v25.91,48.26
  Top 0.406: C38.1 24.26,41.46 C29.2 C28.2 | LED1.C LED2.C LED3.C -9.89,78.69 LED10.C -9.91,74.92 RST_JMPR.3 | C26.- C27.-
  other vias: 41.91,58.42 44.32,58.42 44.32,55.88 41.91,55.88
  cutout Bottom (isolate 0.254): -17.4,115.19 124.71,115.19 124.71,0 124.71,-24.38 10.41,-24.38 -17.4,-24.38
MCLR  (1 unrouted)
MCLR'  (3 unrouted)
N$2
  Top 0.406: LED2.A R4.1
N$9  (2 unrouted)
N$10
  Top 0.406: LED10.A R47.1
N$12
  Top 0.406: LED3.A R5.1
N$37  (1 unrouted)
N$40  (1 unrouted)
N$42
  Top 0.406: LED1.A R33.1
N$43  (1 unrouted)
N$47  (1 unrouted)
PGC1  (1 unrouted)
PGD1  (1 unrouted)
RX  (1 unrouted)
SLEEPALL  (1 unrouted)
STEP1  (1 unrouted)
STEP2  (1 unrouted)
STEP3  (1 unrouted)
STEP4  (1 unrouted)
TX  (1 unrouted)
VBUS  (3 unrouted)
VDD  (20 unrouted)
  Top 0.406: 21.91,35.56 C29.1 21.46,41.46 arc-90 C38.2 C40.2
VM  (9 unrouted)
  Top 0.406: R4.2 R5.2 | C27.+ C26.+